# Altium schematic sheet Display.SchDoc: SR4K_PHY6222_SIMPLIFY
size A4; Revision: V1.2; SheetNumber: 3; SheetTotal: 5
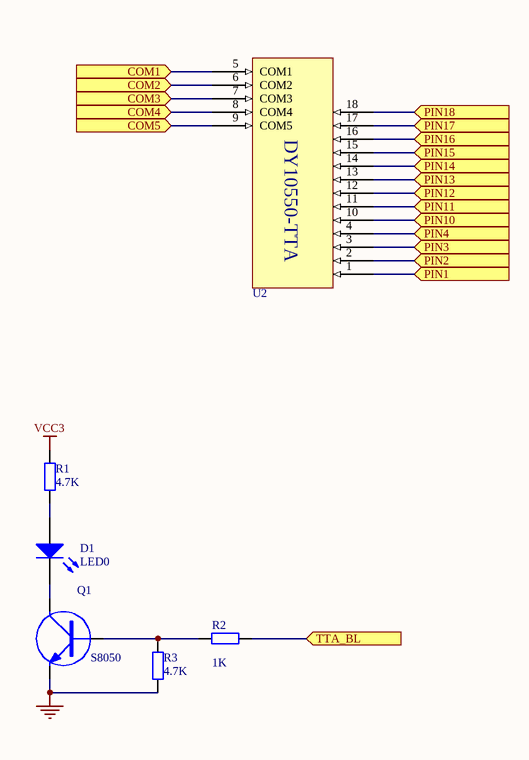
[diagram p0: Display.SchDoc]

## Parts
D1  LED0
Q1  S8050
R1  value 4.7K  (hidden comment: Res2)
R2  value 1K  (hidden comment: Res2)
R3  value 4.7K  (hidden comment: 100K)
U2  DY10550-TTA_1  (value not drawn)

## Ports
COM1 (in), COM2 (in), COM3 (in), COM4 (in), COM5 (in), PIN1 (in), PIN2 (in), PIN3 (in), PIN4 (in), PIN10 (in), PIN11 (in), PIN12 (in), PIN13 (in), PIN14 (in), PIN15 (in), PIN16 (in), PIN17 (in), PIN18 (in), TTA_BL (in)

## Nets
GND: Q1.2(E) R3.1
VCC3: R1.2
COM1: U2.5(COM1) ; port COM1
COM2: U2.6(COM2) ; port COM2
COM3: U2.7(COM3) ; port COM3
COM4: U2.8(COM4) ; port COM4
COM5: U2.9(COM5) ; port COM5
PIN1: U2.1 ; port PIN1
PIN2: U2.2 ; port PIN2
PIN3: U2.3 ; port PIN3
PIN4: U2.4 ; port PIN4
PIN10: U2.10 ; port PIN10
PIN11: U2.11 ; port PIN11
PIN12: U2.12 ; port PIN12
PIN13: U2.13 ; port PIN13
PIN14: U2.14 ; port PIN14
PIN15: U2.15 ; port PIN15
PIN16: U2.16 ; port PIN16
PIN17: U2.17 ; port PIN17
PIN18: U2.18 ; port PIN18
TTA_BL: R2.2 ; port TTA_BL
NetD1_1: D1.1(A) R1.1
NetD1_2: D1.2(K) Q1.3(C)
NetQ1_1: Q1.1(B) R2.1 R3.2

## Notes on the sheet
- Title
- Size:
- Date:
- A4
- Number:
- Time:
- Revision:
- Sheet
- emmovo@outlook.com
- of
- File:
- (in symbol DY10550-TTA_1) DY10550-TTA

## Library data of the parts
D1 = LED0: Typical INFRARED GaAs LED; Published: 8-Jun-2000; LatestRevisionDate: 08-Jul-2005; LatestRevisionNote: Mech Layer 1 removed.; PackageReference: LED-0; Publisher: Altium Limited; PackageDescription: LED; 2 Leads
Q1 = NPN: NPN Transistor
R1-R3 = Res2: Resistor; Published: 8-Jun-2000; LatestRevisionDate: 17-Jul-2002; LatestRevisionNote: Re-released for DXP Platform.; PackageReference: AXIAL-0.4; Publisher: Altium Limited; PackageDescription: Axial Device, Thru-Hole; 2 Leads; 0.4 in Pin Spacing